# EAGLE schematic bl_dora2 (EAGLE 9.4.2)
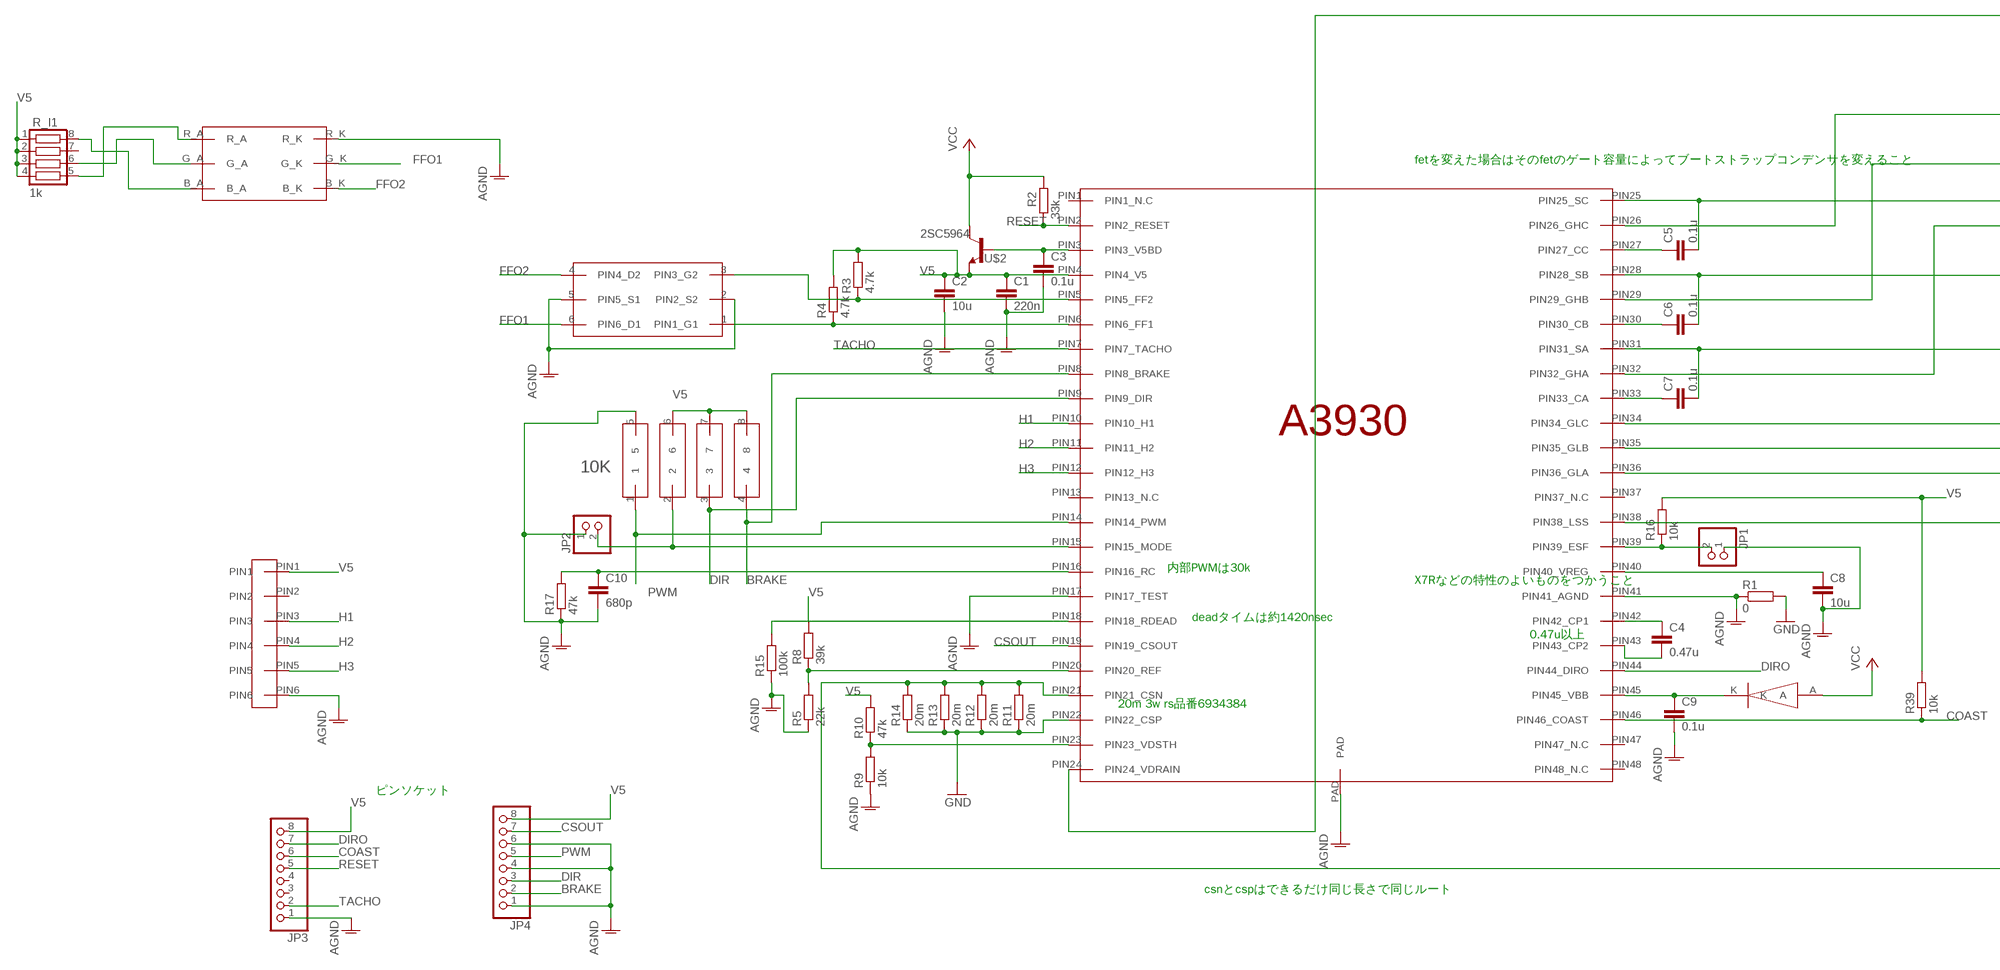
[diagram p0: schematic, sheet 1, part 1 of 2]
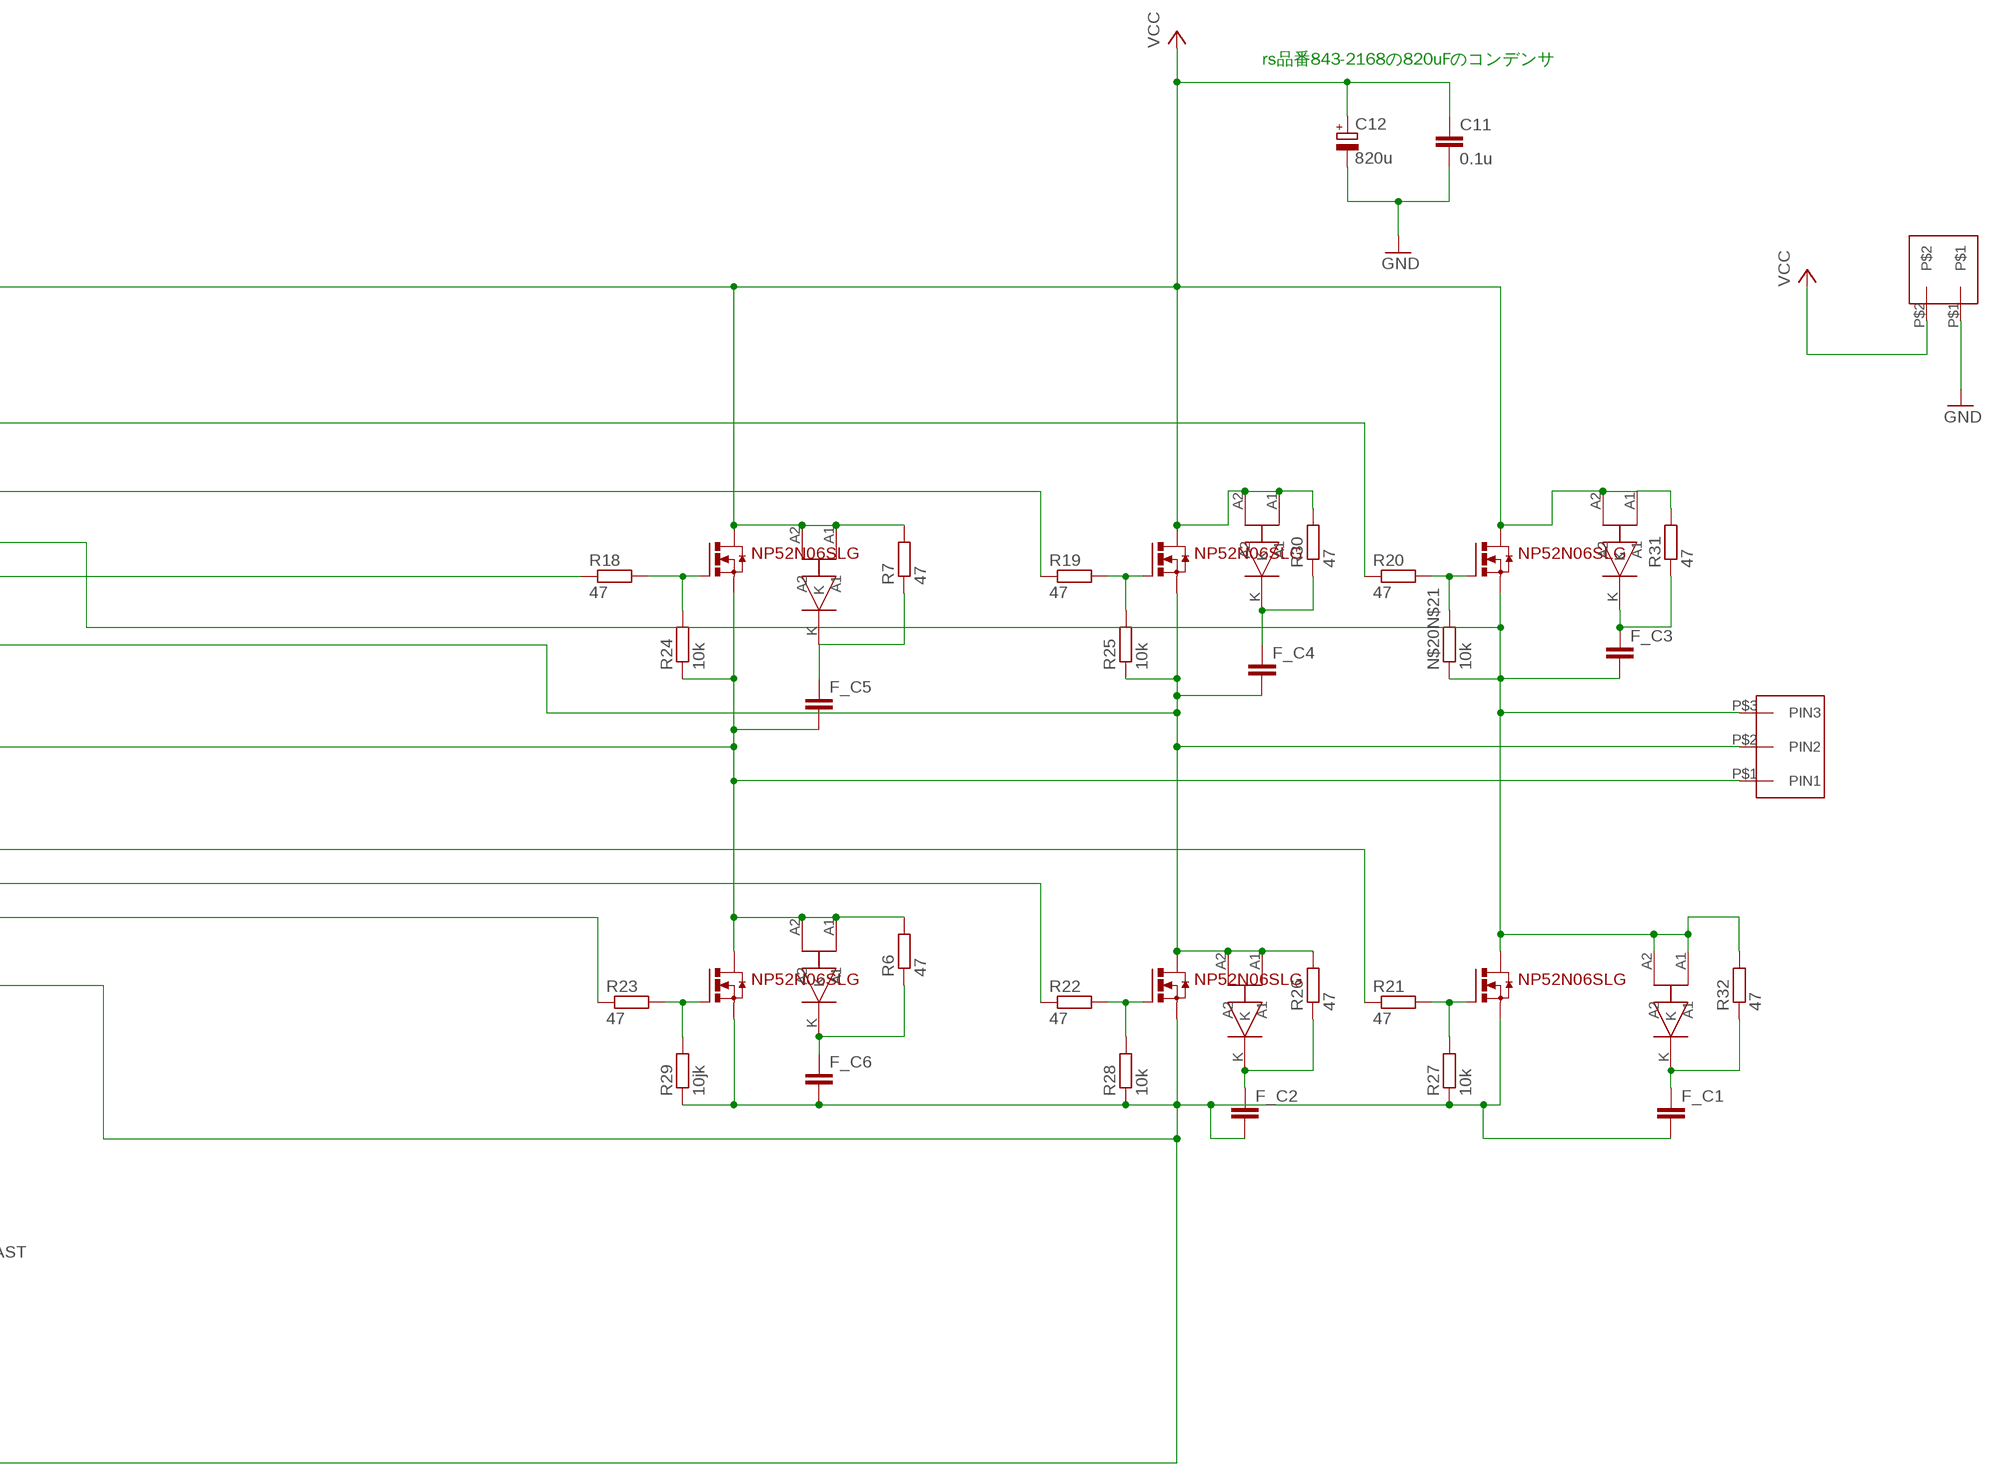
[diagram p1: schematic, sheet 1, part 2 of 2]

## Parts
C1  220n  C-EUC2012  [C2012]
C2  10u  C-EUC2012  [C2012]
C3  0.1u  C-EUC2012  [C2012]
C4  0.47u  C-EUC2012  [C2012]
C5  0.1u  C-EUC2012  [C2012]
C6  0.1u  C-EUC2012  [C2012]
C7  0.1u  C-EUC2012  [C2012]
C8  10u  C-EUC2012  [C2012]
C9  0.1u  C-EUC2012  [C2012]
C10  680p  C-EUC2012  [C2012]
C11  0.1u  C-EUC2012  [C2012]
C12  820u  CPOL-EU153CLV-1012  [153CLV-1012]
F_C1  FIL_CAPA  [FIL_CAPA]
F_C2  FIL_CAPA  [FIL_CAPA]
F_C3  FIL_CAPA  [FIL_CAPA]
F_C4  FIL_CAPA  [FIL_CAPA]
F_C5  FIL_CAPA  [FIL_CAPA]
F_C6  FIL_CAPA  [FIL_CAPA]
JP1  PINHD-1X2  [1X02]
JP2  PINHD-1X2  [1X02]
JP3  PINHD-1X8  [1X08]
JP4  PINHD-1X8  [1X08]
N$20N$21  10k  R-EU_M2012  [M2012]
R1  0  R-EU_M2012  [M2012]
R2  33k  R-EU_M2012  [M2012]
R3  4.7k  R-EU_M2012  [M2012]
R4  4.7k  R-EU_M2012  [M2012]
R5  22k  R-EU_M2012  [M2012]
R6  47  R-EU_R2512  [R2512]
R7  47  R-EU_R2512  [R2512]
R8  39k  R-EU_M2012  [M2012]
R9  10k  R-EU_M2012  [M2012]
R10  47k  R-EU_M2012  [M2012]
R11  20m  R-EU_R2512  [R2512]
R12  20m  R-EU_R2512  [R2512]
R13  20m  R-EU_R2512  [R2512]
R14  20m  R-EU_R2512  [R2512]
R15  100k  R-EU_M2012  [M2012]
R16  10k  R-EU_M2012  [M2012]
R17  47k  R-EU_M2012  [M2012]
R18  47  R-EU_M2012  [M2012]
R19  47  R-EU_M2012  [M2012]
R20  47  R-EU_M2012  [M2012]
R21  47  R-EU_M2012  [M2012]
R22  47  R-EU_M2012  [M2012]
R23  47  R-EU_M2012  [M2012]
R24  10k  R-EU_M2012  [M2012]
R25  10k  R-EU_M2012  [M2012]
R26  47  R-EU_R2512  [R2512]
R27  10k  R-EU_M2012  [M2012]
R28  10k  R-EU_M2012  [M2012]
R29  10jk  R-EU_M2012  [M2012]
R30  47  R-EU_R2512  [R2512]
R31  47  R-EU_R2512  [R2512]
R32  47  R-EU_R2512  [R2512]
R39  10k  R-EU_M2012  [M2012]
R_I1  1k  0603X4RESISTOR  [0603X4RESISTOR]
U$1  A3930  [A3930]
U$2  2SC5964  [2SC5964]
U$3  SSOT6_FET  [SSOT6_FET]
U$4  RGB_LED  [RGB_LED]
U$5  10K  1005X4RESISTOR  [1005X4RESISTOR]
U$6  SMD_DAIOD  [SMD_DAIOD]
U$7  NP52N06SLG  [NP52N06SLG]
U$8  NP52N06SLG  [NP52N06SLG]
U$9  NP52N06SLG  [NP52N06SLG]
U$10  NP52N06SLG  [NP52N06SLG]
U$11  NP52N06SLG  [NP52N06SLG]
U$12  NP52N06SLG  [NP52N06SLG]
U$13  SBR10M100P5Q  [SBR10M100P5Q]
U$14  SBR10M100P5Q  [SBR10M100P5Q]
U$15  SBR10M100P5Q  [SBR10M100P5Q]
U$16  SBR10M100P5Q  [SBR10M100P5Q]
U$17  SBR10M100P5Q  [SBR10M100P5Q]
U$18  SBR10M100P5Q  [SBR10M100P5Q]
U$23  ZH_6P  [ZH_6P]
U$24  XT60  [XT60]
U$25  VL_3P  [VL_3P]

## Nets
AGND: C1.2 C2.2 C3.2 C8.2 C9.2 C10.2 JP1.1 JP2.1 JP3.1 JP4.1 JP4.4 JP4.6 R1.1 R5.1 R9.1 R15.1 R17.1 U$1.PAD U$1.PIN17(PIN17_TEST) U$1.PIN41(PIN41_AGND) U$3.2(PIN2_S2) U$3.5(PIN5_S1) U$4.R_K U$5.5 U$23.PIN6
BRAKE: JP4.2 U$1.PIN8(PIN8_BRAKE) U$5.4
COAST: JP3.6 R39.1 U$1.PIN46(PIN46_COAST)
CSOUT: JP4.7 U$1.PIN19(PIN19_CSOUT)
DIR: JP4.3 U$1.PIN9(PIN9_DIR) U$5.3
DIRO: JP3.7 U$1.PIN44(PIN44_DIRO)
ESF: JP1.2 R16.1 U$1.PIN39(PIN39_ESF)
FFO1: U$3.6(PIN6_D1) U$4.G_K
FFO2: U$3.4(PIN4_D2) U$4.B_K
GND: C11.2 C12.- R1.2 R11.1 R12.1 R13.1 R14.1 U$1.PIN22(PIN22_CSP) U$24.P$1
H1: U$1.PIN10(PIN10_H1) U$23.PIN3
H2: U$1.PIN11(PIN11_H2) U$23.PIN4
H3: U$1.PIN12(PIN12_H3) U$23.PIN5
N$1: C3.1 U$1.PIN3(PIN3_V5BD) U$2.B
N$2: R3.1 U$1.PIN5(PIN5_FF2) U$3.3(PIN3_G2)
N$3: R4.1 U$1.PIN6(PIN6_FF1) U$3.1(PIN1_G1)
N$4: C5.2 F_C3.P$2 N$20N$21.1 R32.2 U$1.PIN25(PIN25_SC) U$11.PIN3_S U$12.PIN2_D U$18.A1 U$18.A2 U$25.P$3(PIN3)
N$5: F_C5.P$1 R7.1 U$13.K
N$6: R9.2 R10.1 U$1.PIN23(PIN23_VDSTH)
N$7: R5.2 R8.1 U$1.PIN20(PIN20_REF)
N$8: F_C1.P$2 F_C2.P$2 F_C6.P$2 R11.2 R12.2 R13.2 R14.2 R27.1 R28.1 R29.1 U$1.PIN21(PIN21_CSN) U$1.PIN38(PIN38_LSS) U$8.PIN3_S U$10.PIN3_S U$12.PIN3_S
N$9: F_C6.P$1 R6.1 U$14.K
N$11: R_I1.5 U$4.R_A
N$12: C4.1 U$1.PIN42(PIN42_CP1)
N$13: JP2.2 U$1.PIN15(PIN15_MODE) U$5.2
N$14: C4.2 U$1.PIN43(PIN43_CP2)
N$15: R15.2 U$1.PIN18(PIN18_RDEAD)
N$16: C5.1 U$1.PIN27(PIN27_CC)
N$17: C6.1 U$1.PIN30(PIN30_CB)
N$18: C7.1 U$1.PIN33(PIN33_CA)
N$19: C7.2 F_C5.P$2 R6.2 R24.1 U$1.PIN31(PIN31_SA) U$7.PIN3_S U$8.PIN2_D U$14.A1 U$14.A2 U$25.P$1(PIN1)
N$21: R_I1.6 U$4.G_A
N$22: C8.1 U$1.PIN40(PIN40_VREG)
N$23: C9.1 U$1.PIN45(PIN45_VBB) U$6.K
N$24: C10.1 R17.2 U$1.PIN16(PIN16_RC)
N$25: R18.2 R24.2 U$7.PIN1_G
N$26: R19.2 R25.2 U$9.PIN1_G
N$27: N$20N$21.2 R20.2 U$11.PIN1_G
N$28: R21.2 R27.2 U$12.PIN1_G
N$29: R22.2 R28.2 U$10.PIN1_G
N$30: R23.2 R29.2 U$8.PIN1_G
N$31: R23.1 U$1.PIN36(PIN36_GLA)
N$32: R22.1 U$1.PIN35(PIN35_GLB)
N$33: R21.1 U$1.PIN34(PIN34_GLC)
N$34: R_I1.8 U$4.B_A
N$35: R18.1 U$1.PIN32(PIN32_GHA)
N$36: R19.1 U$1.PIN29(PIN29_GHB)
N$37: R20.1 U$1.PIN26(PIN26_GHC)
N$38: F_C2.P$1 R26.1 U$15.K
N$39: F_C1.P$1 R32.1 U$18.K
N$40: F_C3.P$1 R31.1 U$17.K
N$42: F_C4.P$1 R30.1 U$16.K
N$50: C6.2 F_C4.P$2 R25.1 R26.2 U$1.PIN28(PIN28_SB) U$9.PIN3_S U$10.PIN2_D U$15.A1 U$15.A2 U$25.P$2(PIN2)
PWM: JP4.5 U$1.PIN14(PIN14_PWM) U$5.1
RESET: JP3.5 R2.1 U$1.PIN2(PIN2_RESET)
TACHO: JP3.2 U$1.PIN7(PIN7_TACHO)
V5: C1.1 C2.1 JP3.8 JP4.8 R3.2 R4.2 R8.2 R10.2 R16.2 R39.2 R_I1.1 R_I1.2 R_I1.3 R_I1.4 U$1.PIN4(PIN4_V5) U$2.E U$5.6 U$5.7 U$5.8 U$23.PIN1
VCC: C11.1 C12.+ R2.2 R7.2 R30.2 R31.2 U$1.PIN24(PIN24_VDRAIN) U$2.C U$2.C@2(C) U$6.A U$7.PIN2_D U$9.PIN2_D U$11.PIN2_D U$13.A1 U$13.A2 U$16.A1 U$16.A2 U$17.A1 U$17.A2 U$24.P$2
Unconnected: JP3.3 JP3.4 R_I1.7 U$1.PIN1(PIN1_N.C) U$1.PIN13(PIN13_N.C) U$1.PIN37(PIN37_N.C) U$1.PIN47(PIN47_N.C) U$1.PIN48(PIN48_N.C) U$23.PIN2

## Notes on the sheet
- rs品番843-2168の820uFのコンデンサ
- fetを変えた場合はそのfetのゲート容量によってブートストラップコンデンサを変えること
- 内部PWMは30k
- X7Rなどの特性のよいものをつかうこと
- deadタイムは約1420nsec
- 0.47u以上
- 20m 3w rs品番6934384
- ピンソケット
- csnとcspはできるだけ同じ長さで同じルート

## Library data of the parts
C1-C11 = rcl:C-EU: CAPACITOR, European symbol; SPICEPREFIX: C
C12 = rcl:CPOL-EU: POLARIZED CAPACITOR, European symbol; SPICEPREFIX: C
F_C1-F_C6 = user:FIL_CAPA: メタライズドポリエステルコンデンサ 0.1u 100v 秋月電子通販コード[MEM104J101RB-5]
JP1 JP2 = pinhead:PINHD-1X2: PIN HEADER
JP3 JP4 = pinhead:PINHD-1X8: PIN HEADER
N$20N$21 R1-R32 R39 = rcl:R-EU_: RESISTOR, European symbol; SPICEPREFIX: R
R_I1 = user:0603X4RESISTOR: 工房に落ちてたやつ...どこが作った物なのかトレランスはどうなのかとか精級は全部不明
U$1 = user:A3930
U$2 = user:2SC5964: rs品番774-0746 PCP
U$3 = user:SSOT6_FET
U$4 = user:RGB_LED: 秋月電子通商 I-12726
U$5 = user:1005X4RESISTOR
U$6 = user:SMD_DAIOD
U$7-U$12 = user:NP52N06SLG
U$13-U$18 = user:SBR10M100P5Q: digikeyに売ってるスーパーバリアダイオード 100V 10A
U$23 = user:ZH_6P
U$24 = user:XT60
U$25 = user:VL_3P